# EAGLE design AnalogKeyPad (EAGLE 7.7.0)
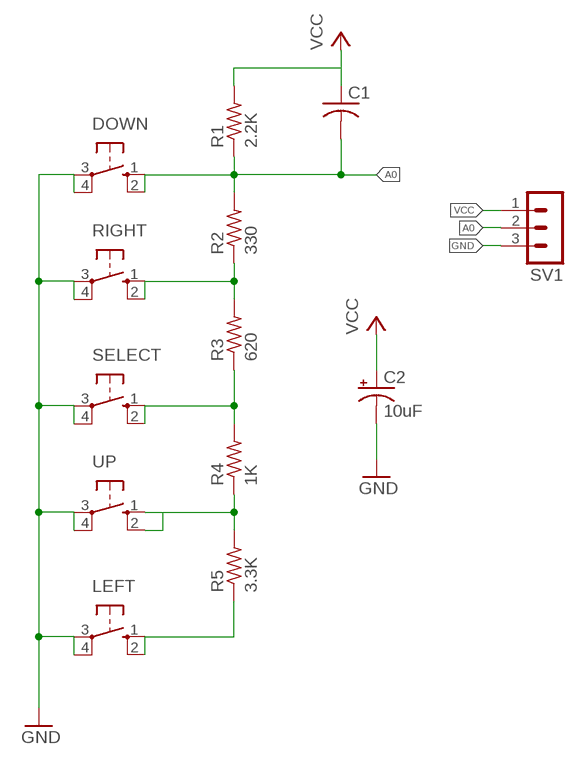
[diagram p0: schematic, sheet 1]

## Parts
C1  C-US050-024X044  [C050-024X044]
C2  10uF  CPOL-USE2,5-6E  [E2,5-6E]
DOWN  10-XX  [B3F-10XX]
LEFT  10-XX  [B3F-10XX]
R1  2.2K  R-US_0207/7  [0207/7]
R2  330  R-US_0207/7  [0207/7]
R3  620  R-US_0207/7  [0207/7]
R4  1K  R-US_0207/7  [0207/7]
R5  3.3K  R-US_0207/7  [0207/7]
RIGHT  10-XX  [B3F-10XX]
SELECT  10-XX  [B3F-10XX]
SV1  MA03-1  [MA03-1]
UP  10-XX  [B3F-10XX]

## Nets
A0: C1.2 DOWN.1(S) DOWN.2(S1) R1.1 R2.2 SV1.2
GND: C2.- DOWN.3(P) DOWN.4(P1) LEFT.3(P) LEFT.4(P1) RIGHT.3(P) RIGHT.4(P1) SELECT.3(P) SELECT.4(P1) SV1.3 UP.3(P) UP.4(P1)
N$2: R2.1 R3.2 RIGHT.1(S) RIGHT.2(S1)
N$4: LEFT.1(S) LEFT.2(S1) R5.1
N$5: R3.1 R4.2 SELECT.1(S) SELECT.2(S1)
N$6: R4.1 R5.2 UP.1(S) UP.2(S1)
VCC: C1.1 C2.+ R1.2 SV1.1

## Library data of the parts
C1 = rcl2:C-US: CAPACITOR, American symbol
C2 = rcl2:CPOL-US: POLARIZED CAPACITOR, American symbol
DOWN LEFT RIGHT SELECT UP = switch-omron:10-XX: OMRON SWITCH; MPN: B3F-1000; OC_FARNELL: 176432; OC_NEWARK: 36M3542
R1-R5 = rcl2:R-US_: RESISTOR, American symbol
SV1 = con-lstb:MA03-1: PIN HEADER; OC_FARNELL: unknown; OC_NEWARK: unknown

## Board
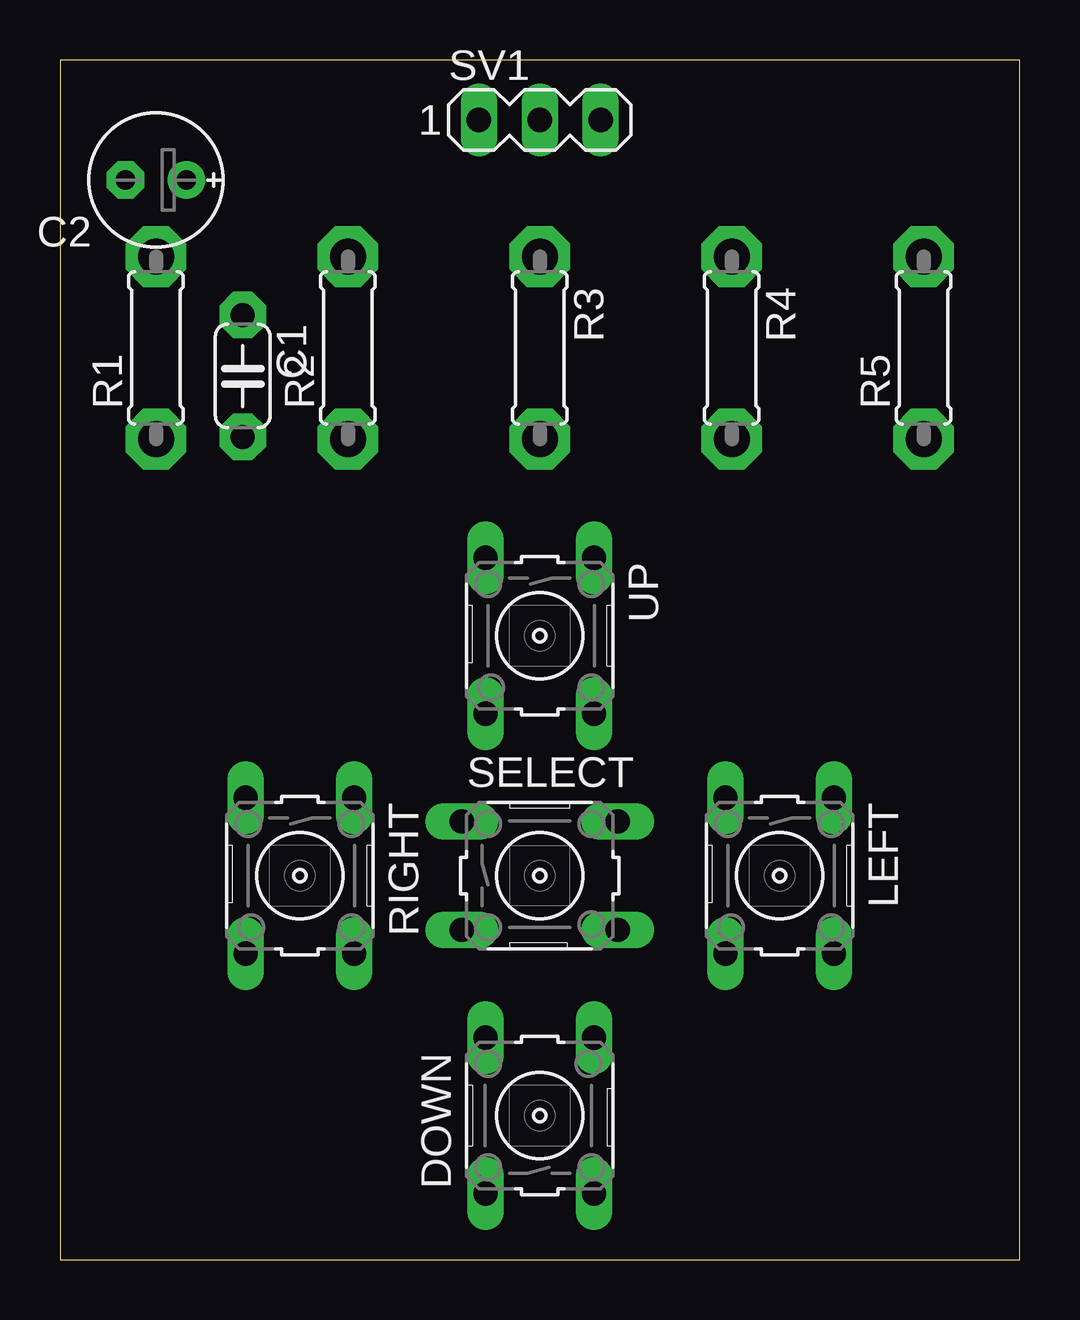
[diagram p1: board, top side]
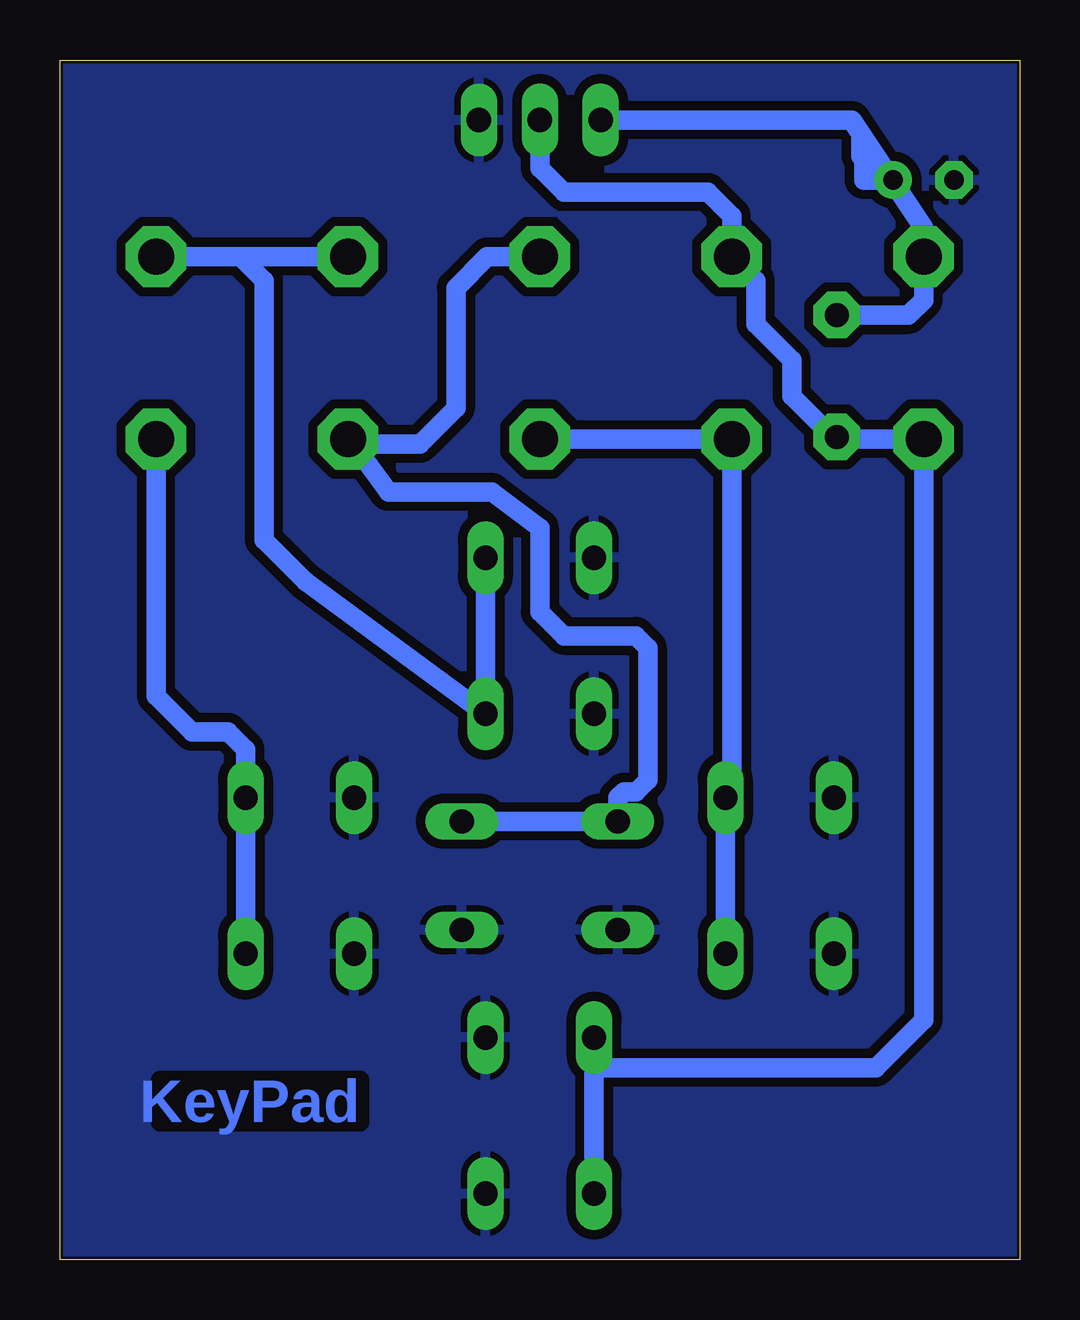
[diagram p2: board, bottom side, seen from below]

Size 40 x 50 mm. Coordinates in mm from the lower left corner, seen from the top.
Outline: 0,0 40,0 40,50 0,50 0,0
Copper layers (1*16): Top 0.035mm / dielectric 1.5mm / Bottom 0.035mm
Design rules "default *": minimum track width 10mil, minimum drill 24mil, track to track 15mil, track to pad 15mil, pad to pad 8mil, via to via 8mil, smd to smd 8mil, copper to edge 5mil, drill to drill 8mil, minimum pad ring 10mil, minimum via ring 8mil, stop-mask expansion 4mil, vias tented up to drill 0mil, thermal gap 10mil

### Footprints (pad centres in the part's own frame; a part is rotated, then mirrored left to right if it is on the bottom)
C050-024X044 = drill 1 pad 1.93 octagon: 1 -2.54,0; 2 2.54,0
E2,5-6E = drill 0.813 pad 1.575: + -1.27,0 | drill 0.813 pad 1.575 octagon: - 1.27,0
B3F-10XX = drill 1.016 long: 1 -3.251,2.261; 2 3.251,2.261; 3 -3.251,-2.261; 4 3.251,-2.261
0207/7 = drill 1.5 pad 2.54 octagon: 1 -3.81,0; 2 3.81,0
MA03-1 = drill 1.016 long: 1 -2.54,0; 2 0,0; 3 2.54,0

### Placement (x,y rotation side)
C1  7.62,36.83 270 top
C2  4,45 180 top
DOWN  20,6 90 top
LEFT  30,16 270 top
R1  4,38 90 top
R2  12,38 90 top
R3  20,38 270 top
R4  28,38 270 top
R5  36,38 90 top
RIGHT  10,16 270 top
SELECT  20,16 0 top
SV1  20,47.5 0 top
UP  20,26 270 top

### Tracks (layer width: path | path; a pad name or v marks a point on that pad's centre or on a via)
A0
  Bottom 0.813: SV1.2 20,45.5 19,44.5 13,44.5 12,43.5 R2.2 11,40.81 11,39 9.5,37.5 9.5,36 7.79,34.29 C1.2 7.52,34.19 R1.1 4,10 6,8 17.74,8 | DOWN.2 17.74,8 | 17.74,8 DOWN.1
GND
  pour Bottom: 0,50 40,50 40,0 0,0
N$2
  Bottom 0.813: R3.2 R2.1 12,19.51 RIGHT.1 RIGHT.2
N$4
  Bottom 0.813: R5.1 36,23.5 34.5,22 33,22 32.26,21.26 LEFT.1 LEFT.2
N$5
  Bottom 0.813: 27.66,33.84 26.31,32 22,32 20,30.5 20,27 19,26 16,26 15.5,25.5 15.5,20 16,19.5 16.5,19.5 16.75,19.25 SELECT.1 SELECT.2 | 27.66,33.84 R4.2 | R3.1 22.19,41.81 23.5,40.5 23.5,35.5 25,34 27.5,34 27.66,33.84
N$6
  Bottom 0.813: R4.1 32.5,41.81 | 32.5,41.81 R5.2 | 32.5,41.81 31.5,40.81 31.5,30 29.76,28.26 UP.2 UP.1
VCC
  Bottom 0.813: 6.62,46.92 4,43 R1.2 4,40 4.63,39.37 C1.1 | 6.62,46.92 7,47.5 SV1.1 | C2.+ 6.5,45 6.5,46 6.62,46 6.62,46.92

### Text on the board
Bottom: KeyPad